# Altium schematic sheet Main_Board.SchDoc
size A; SheetNumber: 1; SheetTotal: 6
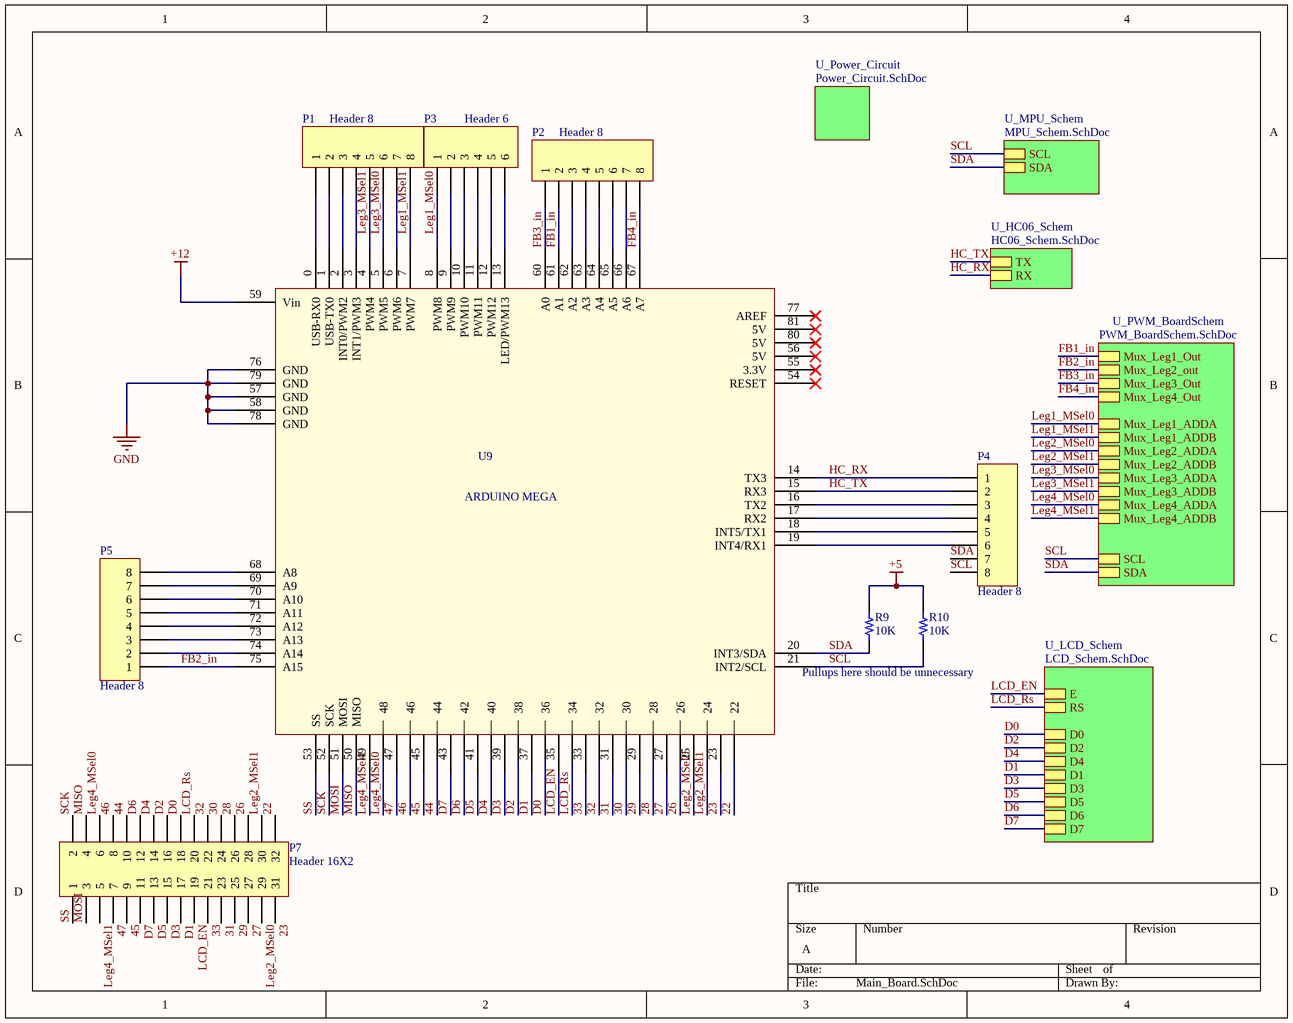
[diagram p0: Main_Board.SchDoc]

## Parts
P1  Header 8  [HDR1X8]
P2  Header 8  [HDR1X8]
P3  Header 6  [HDR1X6]
P4  Header 8  [HDR1X8]
P5  Header 8  [HDR1X8]
P7  Header 16X2  [HDR2X16]
R9  10K  [RES 1206_3216]
R10  10K  [RES 1206_3216]
U9  ARDUINO MEGA  [ARDUINO MEGA]

## Sub-sheets
U_HC06_Schem = HC06_Schem.SchDoc: TX, RX
U_LCD_Schem = LCD_Schem.SchDoc: E, RS, D0, D2, D4, D1, D3, D5, D6, D7
U_MPU_Schem = MPU_Schem.SchDoc: SCL, SDA
U_Power_Circuit = Power_Circuit.SchDoc: no entries
U_PWM_BoardSchem = PWM_BoardSchem.SchDoc: SCL, SDA, Mux_Leg2_ADDB, Mux_Leg4_Out, Mux_Leg3_ADDB, Mux_Leg2_ADDA, Mux_Leg3_ADDA, Mux_Leg1_ADDB, Mux_Leg4_ADDA, Mux_Leg4_ADDB, Mux_Leg3_Out, Mux_Leg1_Out, Mux_Leg1_ADDA, Mux_Leg2_out

## Nets
+5: R9.2 R10.2
+12: U9.59(Vin)
GND: U9.57(GND) U9.58(GND) U9.76(GND) U9.78(GND) U9.79(GND)
22: P7.32 U9.22
23: P7.31 U9.23
26: P7.28 U9.26
27: P7.27 U9.27
28: P7.26 U9.28
29: P7.25 U9.29
30: P7.24 U9.30
31: P7.23 U9.31
32: P7.22 U9.32
33: P7.21 U9.33
44: P7.10 U9.44
45: P7.9 U9.45
46: P7.8 U9.46
47: P7.7 U9.47
D0: P7.18 U9.36 ; sheet U_LCD_Schem/D0
D1: P7.17 U9.37 ; sheet U_LCD_Schem/D1
D2: P7.16 U9.38 ; sheet U_LCD_Schem/D2
D3: P7.15 U9.39 ; sheet U_LCD_Schem/D3
D4: P7.14 U9.40 ; sheet U_LCD_Schem/D4
D5: P7.13 U9.41 ; sheet U_LCD_Schem/D5
D6: P7.12 U9.42 ; sheet U_LCD_Schem/D6
D7: P7.11 U9.43 ; sheet U_LCD_Schem/D7
FB1_in: P2.2 U9.61(A1) ; sheet U_PWM_BoardSchem/Mux_Leg1_Out
FB2_in: P5.1 U9.75(A15) ; sheet U_PWM_BoardSchem/Mux_Leg2_out
FB3_in: P2.1 U9.60(A0) ; sheet U_PWM_BoardSchem/Mux_Leg3_Out
FB4_in: P2.8 U9.67(A7) ; sheet U_PWM_BoardSchem/Mux_Leg4_Out
HC_RX: P4.1 U9.14(TX3) ; sheet U_HC06_Schem/RX
HC_TX: P4.2 U9.15(RX3) ; sheet U_HC06_Schem/TX
LCD_EN: P7.19 U9.35 ; sheet U_LCD_Schem/E
LCD_Rs: P7.20 U9.34 ; sheet U_LCD_Schem/RS
Leg1_MSel0: P3.1 U9.8(PWM8) ; sheet U_PWM_BoardSchem/Mux_Leg1_ADDA
Leg1_MSel1: P1.8 U9.7(PWM7) ; sheet U_PWM_BoardSchem/Mux_Leg1_ADDB
Leg2_MSel0: P7.29 U9.25 ; sheet U_PWM_BoardSchem/Mux_Leg2_ADDA
Leg2_MSel1: P7.30 U9.24 ; sheet U_PWM_BoardSchem/Mux_Leg2_ADDB
Leg3_MSel0: P1.6 U9.5(PWM5) ; sheet U_PWM_BoardSchem/Mux_Leg3_ADDA
Leg3_MSel1: P1.5 U9.4(PWM4) ; sheet U_PWM_BoardSchem/Mux_Leg3_ADDB
Leg4_MSel0: P7.6 U9.48 ; sheet U_PWM_BoardSchem/Mux_Leg4_ADDA
Leg4_MSel1: P7.5 U9.49 ; sheet U_PWM_BoardSchem/Mux_Leg4_ADDB
MISO: P7.4 U9.50(MISO)
MOSI: P7.3 U9.51(MOSI)
SCK: P7.2 U9.52(SCK)
SCL: P4.8 R10.1 U9.21(INT2/SCL) ; sheet U_MPU_Schem/SCL, sheet U_PWM_BoardSchem/SCL
SDA: P4.7 R9.1 U9.20(INT3/SDA) ; sheet U_MPU_Schem/SDA, sheet U_PWM_BoardSchem/SDA
SS: P7.1 U9.53(SS)
NetP1_1: P1.1 U9.0(USB-RX0)
NetP1_2: P1.2 U9.1(USB-TX0)
NetP1_3: P1.3 U9.2(INT0/PWM2)
NetP1_4: P1.4 U9.3(INT1/PWM3)
NetP1_7: P1.7 U9.6(PWM6)
NetP2_3: P2.3 U9.62(A2)
NetP2_4: P2.4 U9.63(A3)
NetP2_5: P2.5 U9.64(A4)
NetP2_6: P2.6 U9.65(A5)
NetP2_7: P2.7 U9.66(A6)
NetP3_2: P3.2 U9.9(PWM9)
NetP3_3: P3.3 U9.10(PWM10)
NetP3_4: P3.4 U9.11(PWM11)
NetP3_5: P3.5 U9.12(PWM12)
NetP3_6: P3.6 U9.13(LED/PWM13)
NetP4_3: P4.3 U9.16(TX2)
NetP4_4: P4.4 U9.17(RX2)
NetP4_5: P4.5 U9.18(INT5/TX1)
NetP4_6: P4.6 U9.19(INT4/RX1)
NetP5_2: P5.2 U9.74(A14)
NetP5_3: P5.3 U9.73(A13)
NetP5_4: P5.4 U9.72(A12)
NetP5_5: P5.5 U9.71(A11)
NetP5_6: P5.6 U9.70(A10)
NetP5_7: P5.7 U9.69(A9)
NetP5_8: P5.8 U9.68(A8)

Not connected (* = marked no-connect by the designer): U9 54(RESET)* 55(3.3V)* 56(5V)* 77(AREF)* 80(5V)* 81(5V)*

## Notes on the sheet
- Pullups here should be unnecessary

## Library data of the parts
P1 P2 P4 P5 = Header 8: Header, 8-Pin; LatestRevisionDate: 17-Jul-2002; LatestRevisionNote: Re-released for DXP Platform.; Publisher: Altium Limited
P3 = Header 6: Header, 6-Pin; LatestRevisionDate: 17-Jul-2002; LatestRevisionNote: Re-released for DXP Platform.; Publisher: Altium Limited
P7 = Header 16X2: Header, 16-Pin, Dual row; LatestRevisionDate: 17-Jul-2002; LatestRevisionNote: Re-released for DXP Platform.; Publisher: Altium Limited
R9 R10 = ESR18EZPF1002: RES SMD 10K OHM 1% 1/2W 1206; Manufacturer: Rohm Semiconductor; Power (Watts): 0.5W, 1/2W; Resistance: 10 kOhms; Temperature Coefficient: ±100ppm/°C; Value: 10 kOhms; Part Number: ESR18EZPF1002; ComponentLink1Description: Datasheet; ComponentLink1URL: https://www.rohm.com/datasheet/ESR01MZPF/esr-e; ComponentLink2Description: DigiKey Link; ComponentLink2URL: https://www.digikey.com/en/products/detail/rohm-semiconductor/ESR18EZPF1002/1983592; Composition: Thick Film; Device Package: 1206 (3216 Metric); Features: Automotive AEC-Q200, Pulse Withstanding; Height - Seated (Max): 0.026" (0.65mm); LastUpdated: 9/19/2022 1:29:57 PM; Lifecycle Status: Active; Minimum Order: 1; Number of Terminations: 2; Operating Temperature: -55°C ~ 155°C; Package / Case: 1206 (3216 Metric); Packaging: TapeAndReel; PartId: 26965; Part Status: Active; Price: 0.02; Ratings: AEC-Q200; Series: ESR; Size / Dimension: 0.126" L x 0.063" W (3.20mm x 1.60mm); Supplier 1: DigiKey; Supplier Part Number 1: RHM10.0KAFCT-ND; Supplier Device Package: 1206; Tolerance: ±1%